# Altium schematic sheet robocar.SchDoc: FHGR_A3_landscape
size A2; Date: 18.07.2017; DrawnBy: G.P. Catregn; Organization: HTW Chur; Address1: Pulvermühlestrasse 57; Address2: 7004 Chur; Address3: Switzerland; DocumentNumber: 1; Revision: V1.0; SheetNumber: 1; SheetTotal: 2; DocumentName: HTW Template
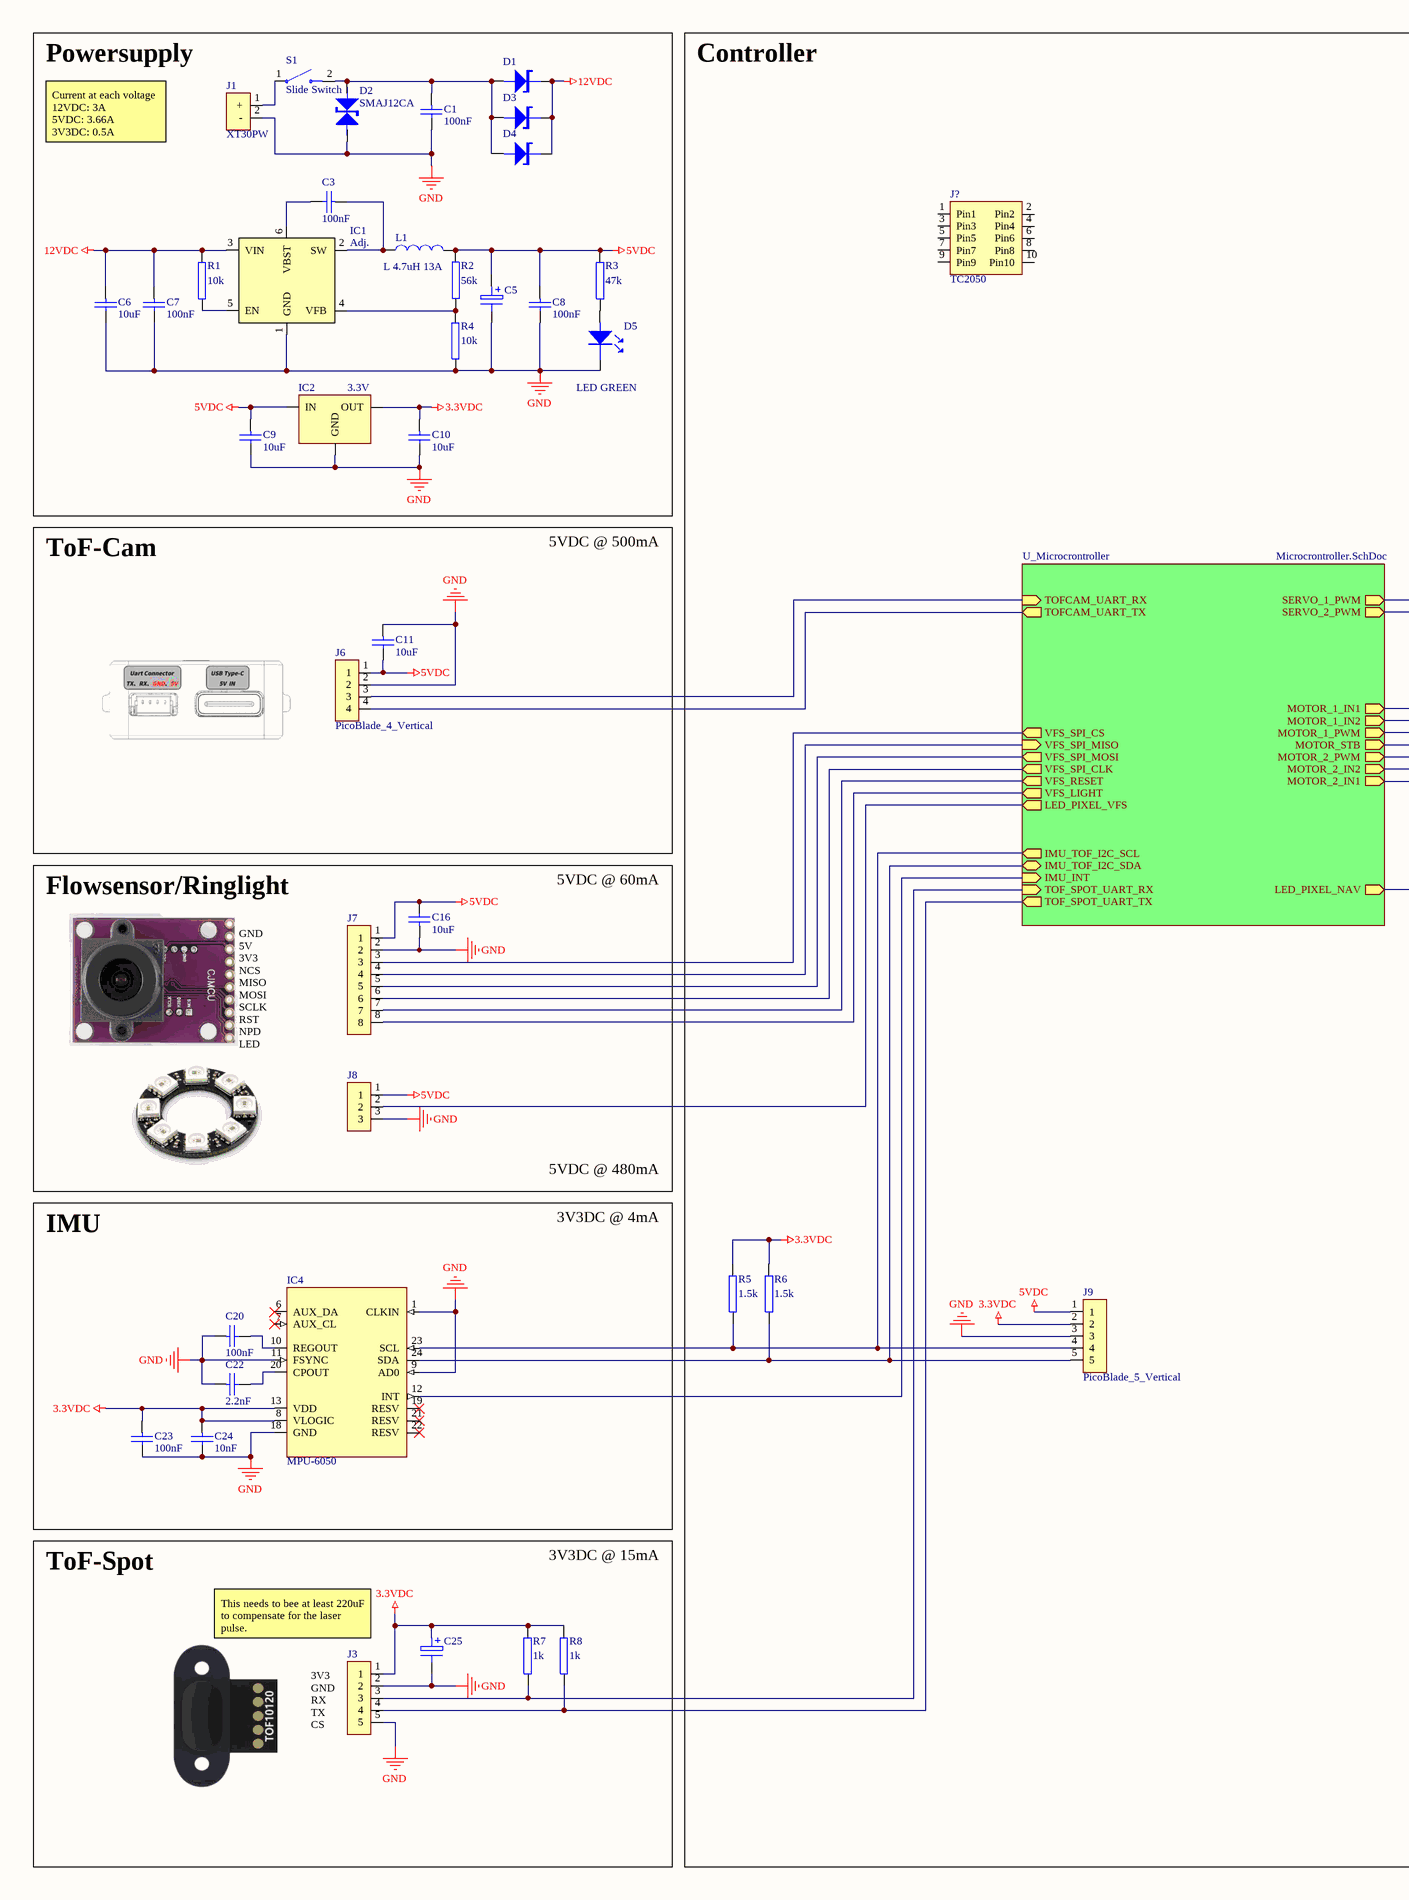
[diagram p0: robocar.SchDoc, left]
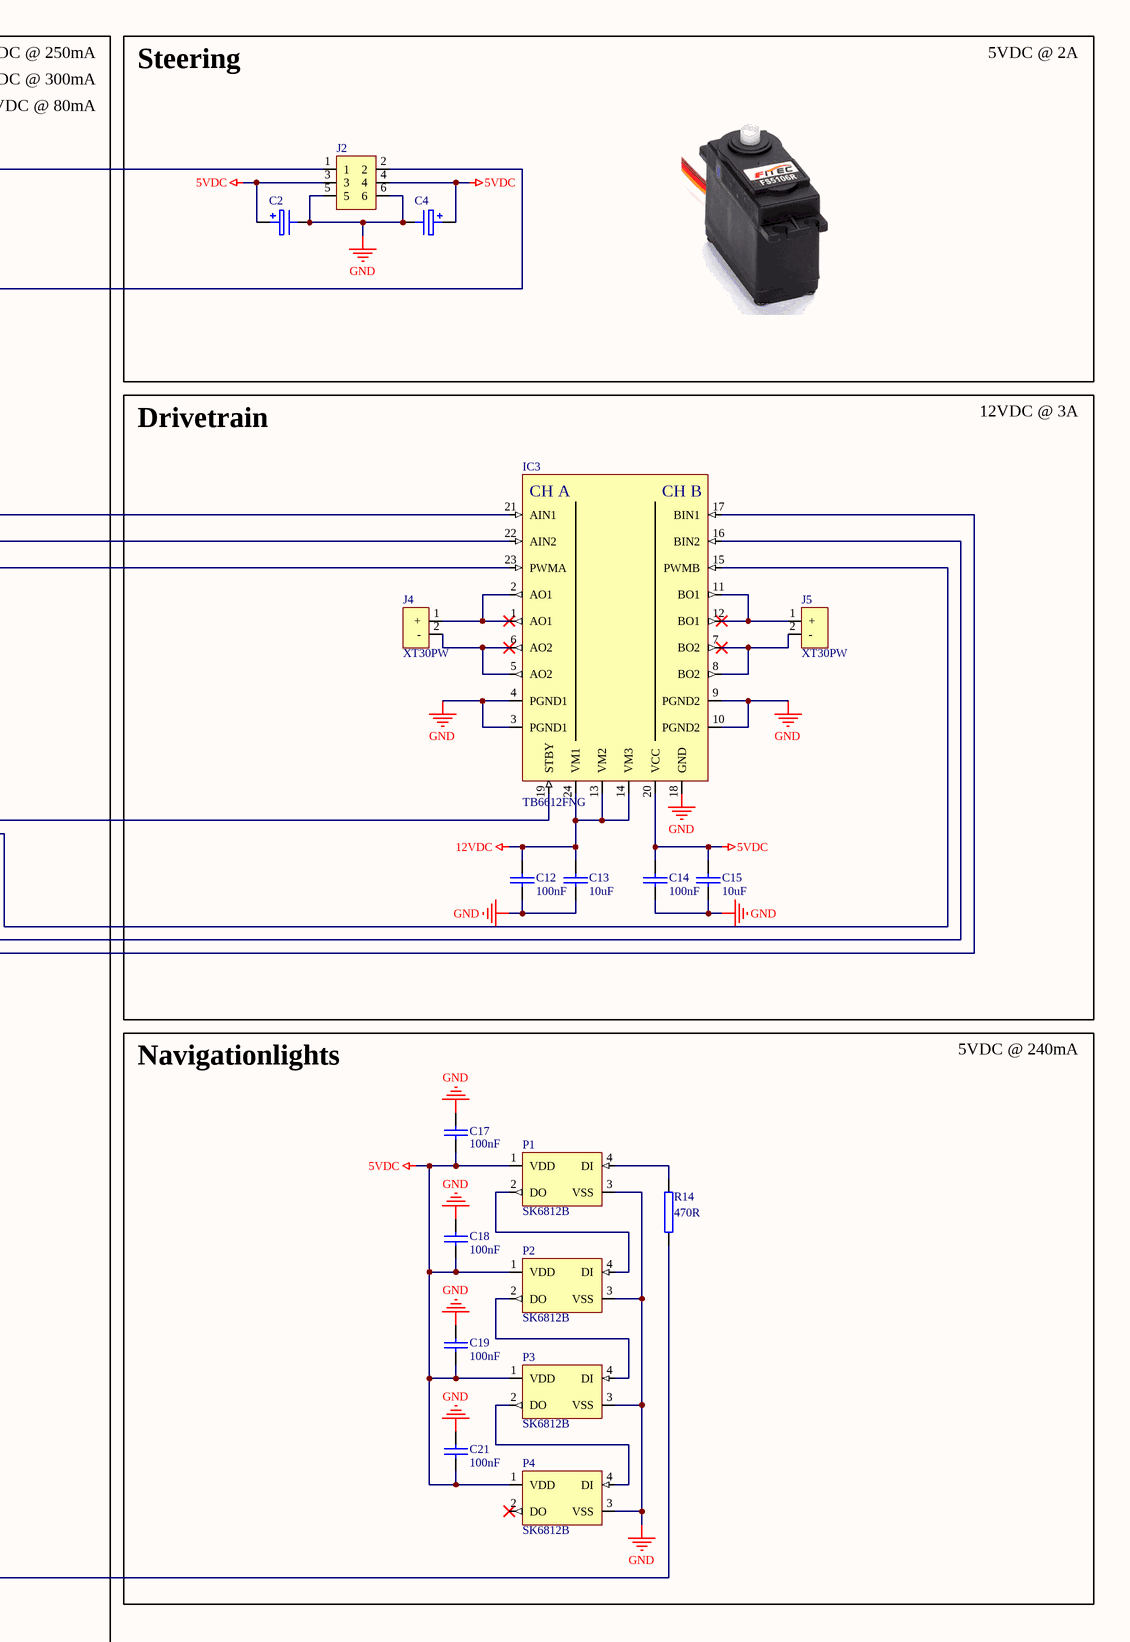
[diagram p1: robocar.SchDoc, right]

## Parts
C1  value 100nF  [0603]  (hidden comment: C 100nF 0603)
C2  C 47uF ALUM  [HA1C470WR]  (value not drawn)
C3  value 100nF  [0603]  (hidden comment: C 100nF 0603)
C4  C 47uF ALUM  [HA1C470WR]  (value not drawn)
C5  C 47uF ALUM  [HA1C470WR]  (value not drawn)
C6  value 10uF  [C_1210_A]  (hidden comment: C 10uF 1210)
C7  value 100nF  [0603]  (hidden comment: C 100nF 0603)
C8  value 100nF  [0603]  (hidden comment: C 100nF 0603)
C9  value 10uF  [0603]  (hidden comment: C 10uF 0603)
C10  value 10uF  [0603]  (hidden comment: C 10uF 0603)
C11  value 10uF  [0603]  (hidden comment: C 10uF 0603)
C12  value 100nF  [0603]  (hidden comment: C 100nF 0603)
C13  value 10uF  [C_1210_A]  (hidden comment: C 10uF 1210)
C14  value 100nF  [0603]  (hidden comment: C 100nF 0603)
C15  value 10uF  [0603]  (hidden comment: C 10uF 0603)
C16  value 10uF  [0603]  (hidden comment: C 10uF 0603)
C17  value 100nF  [0603]  (hidden comment: C 100nF 0603)
C18  value 100nF  [0603]  (hidden comment: C 100nF 0603)
C19  value 100nF  [0603]  (hidden comment: C 100nF 0603)
C20  value 100nF  [0603]  (hidden comment: C 100nF 0603)
C21  value 100nF  [0603]  (hidden comment: C 100nF 0603)
C22  value 2.2nF  [0603]  (hidden comment: C 2.2nF 0603)
C23  value 100nF  [0603]  (hidden comment: C 100nF 0603)
C24  value 10nF  [0603]  (hidden comment: C 10nF 0603)
C25  (no value)  [UCD1H221MNL1GS]
D1  Schottky 60V/2A  [SOD-123FL]  (value not drawn)
D2  SMAJ12CA  [SMA]
D3  Schottky 60V/2A  [SOD-123FL]  (value not drawn)
D4  Schottky 60V/2A  [SOD-123FL]  (value not drawn)
D5  LED GREEN  [LED_1206]
IC1  Voltage Out: Adj.  [SOT23-6]  (hidden comment: Buck_5A_17V)
IC2  Voltage Out: 3.3V  [SOT223]  (hidden comment: LDO_1A_3V3)
IC3  TB6612FNG  [SOP65P760X160-24N]
IC4  MPU-6050  [MPU_6050]
J1  XT30PW  [XT30PW-UP-M]
J2  Pinheader_2x3  [61300621121]  (value not drawn)
J3  PicoBlade_5_Vertical  [PicoBlade_5_Vertical]  (value not drawn)
J4  XT30PW  [XT30PW-UP-F]
J5  XT30PW  [XT30PW-UP-F]
J6  PicoBlade_4_Vertical  [PicoBlade_4_Vertical]
J7  PicoBlade_8_Vertical  [PicoBlade_8_Vertical]  (value not drawn)
J8  PicoBlade_3_Vertical  [PicoBlade_3_Vertical]  (value not drawn)
J9  PicoBlade_5_Vertical  [PicoBlade_5_Vertical]
J?  TC2050  [TC2050]
L1  L 4.7uH 13A  [SRP1040VA]
P1  SK6812B  [SK6812B]
P2  SK6812B  [SK6812B]
P3  SK6812B  [SK6812B]
P4  SK6812B  [SK6812B]
R1  value 10k  [0805]  (hidden comment: R 10K 0805)
R2  value 56k  [0805]  (hidden comment: R 56K 0805)
R3  value 47k  [0805]  (hidden comment: R 47K 0805)
R4  value 10k  [0805]  (hidden comment: R 10K 0805)
R5  value 1.5k  [0805]  (hidden comment: R 1K5 0805)
R6  value 1.5k  [0805]  (hidden comment: R 1K5 0805)
R7  value 1k  [0805]  (hidden comment: R 1K 0805)
R8  value 1k  [0805]  (hidden comment: R 1K 0805)
R14  value 470R  [0805]  (hidden comment: R 220R 0805)
S1  Slide Switch  [SW_GF_123_0054]

## Blocks framed on the sheet
Powersupply: C1 C3 C5-C10 D1-D5 IC1 IC2 J1 L1 R1-R4 S1
Controller: J9 J? R5 R6
Steering: C2 C4 J2
Drivetrain: C12-C15 IC3 J4 J5
ToF-Cam: C11 J6
Flowsensor/Ringlight: C16 J7 J8
Navigationlights: C17-C19 C21 P1-P4 R14
IMU: C20 C22-C24 IC4
ToF-Spot: C25 J3 R7 R8

## Sub-sheets
U_Microcrontroller = Microcrontroller.SchDoc: TOFCAM_UART_RX (in), VFS_SPI_MOSI (out), VFS_SPI_MISO (in), VFS_SPI_CS (out), VFS_SPI_CLK (out), VFS_RESET (out), TOFCAM_UART_TX (out), TOF_SPOT_UART_RX (in), TOF_SPOT_UART_TX (out), LED_PIXEL_VFS (out), LED_PIXEL_NAV (out), IMU_TOF_I2C_SCL (out), IMU_TOF_I2C_SDA (bidir), MOTOR_1_IN1 (out), MOTOR_1_IN2 (out), MOTOR_1_PWM (out), MOTOR_2_IN1 (out), MOTOR_2_IN2 (out), MOTOR_2_PWM (out), MOTOR_STB (out), SERVO_1_PWM (out), SERVO_2_PWM (out), VFS_LIGHT (out), IMU_INT (in)

## Nets
3.3VDC: C10.1 C23.1 C24.1 C25.1 IC2.D(OUT) IC4.8(VLOGIC) IC4.13(VDD) J3.1 J9.2 R5.2 R6.2 R7.2 R8.2
5VDC: C2.1 C4.1 C5.1 C8.1 C9.1 C11.2 C14.1 C15.1 C16.2 C17.1 C18.1 C19.1 C21.1 IC2.S(IN) IC3.20(VCC) J2.3 J2.4 J6.1 J7.1 J8.1 J9.1 L1.2 P1.1(VDD) P2.1(VDD) P3.1(VDD) P4.1(VDD) R2.1 R3.2
12VDC: C6.1 C7.1 C12.1 C13.1 D1.K D3.K D4.K IC1.3(VIN) IC3.13(VM2) IC3.14(VM3) IC3.24(VM1) R1.2
GND: C1.2 C2.2 C4.2 C5.2 C6.2 C7.2 C8.2 C9.2 C10.2 C11.1 C12.2 C13.2 C14.2 C15.2 C16.1 C17.2 C18.2 C19.2 C20.1 C21.2 C22.1 C23.2 C24.2 C25.2 D2.A D5.K IC1.1(GND) IC2.G(GND) IC3.3(PGND1) IC3.4(PGND1) IC3.9(PGND2) IC3.10(PGND2) IC3.18(GND) IC4.1(CLKIN) IC4.9(AD0) IC4.11(FSYNC) IC4.18(GND) J1.2(-) J2.5 J2.6 J3.2 J3.5 J6.2 J7.2 J8.3 J9.3 P1.3(VSS) P2.3(VSS) P3.3(VSS) P4.3(VSS) R4.1
NetC1_1: C1.1 D1.A D2.K D3.A D4.A S1.2(C)
NetC3_1: C3.1 IC1.2(SW) L1.1
NetC3_2: C3.2 IC1.6(VBST)
NetC20_2: C20.2 IC4.10(REGOUT)
NetC22_2: C22.2 IC4.20(CPOUT)
NetD5_A: D5.A R3.1
NetIC1_4: IC1.4(VFB) R2.2 R4.2
NetIC1_5: IC1.5(EN) R1.1
NetIC3_1: IC3.1(AO1) IC3.2(AO1) J4.1(+)
NetIC3_5: IC3.5(AO2) IC3.6(AO2) J4.2(-)
NetIC3_7: IC3.7(BO2) IC3.8(BO2) J5.2(-)
NetIC3_11: IC3.11(BO1) IC3.12(BO1) J5.1(+)
NetIC3_15: IC3.15(PWMB) ; sheet U_Microcrontroller/MOTOR_2_PWM
NetIC3_16: IC3.16(BIN2) ; sheet U_Microcrontroller/MOTOR_2_IN2
NetIC3_17: IC3.17(BIN1) ; sheet U_Microcrontroller/MOTOR_2_IN1
NetIC3_19: IC3.19(STBY) ; sheet U_Microcrontroller/MOTOR_STB
NetIC3_21: IC3.21(AIN1) ; sheet U_Microcrontroller/MOTOR_1_IN1
NetIC3_22: IC3.22(AIN2) ; sheet U_Microcrontroller/MOTOR_1_IN2
NetIC3_23: IC3.23(PWMA) ; sheet U_Microcrontroller/MOTOR_1_PWM
NetIC4_12: IC4.12(INT) ; sheet U_Microcrontroller/IMU_INT
NetIC4_23: IC4.23(SCL) J9.4 R5.1 ; sheet U_Microcrontroller/IMU_TOF_I2C_SCL
NetIC4_24: IC4.24(SDA) J9.5 R6.1 ; sheet U_Microcrontroller/IMU_TOF_I2C_SDA
NetJ1_1: J1.1(+) S1.1(A)
NetJ2_1: J2.1 ; sheet U_Microcrontroller/SERVO_1_PWM
NetJ2_2: J2.2 ; sheet U_Microcrontroller/SERVO_2_PWM
NetJ3_3: J3.3 R7.1 ; sheet U_Microcrontroller/TOF_SPOT_UART_RX
NetJ3_4: J3.4 R8.1 ; sheet U_Microcrontroller/TOF_SPOT_UART_TX
NetJ6_3: J6.3 ; sheet U_Microcrontroller/TOFCAM_UART_RX
NetJ6_4: J6.4 ; sheet U_Microcrontroller/TOFCAM_UART_TX
NetJ7_3: J7.3 ; sheet U_Microcrontroller/VFS_SPI_CS
NetJ7_4: J7.4 ; sheet U_Microcrontroller/VFS_SPI_MISO
NetJ7_5: J7.5 ; sheet U_Microcrontroller/VFS_SPI_MOSI
NetJ7_6: J7.6 ; sheet U_Microcrontroller/VFS_SPI_CLK
NetJ7_7: J7.7 ; sheet U_Microcrontroller/VFS_RESET
NetJ7_8: J7.8 ; sheet U_Microcrontroller/VFS_LIGHT
NetJ8_2: J8.2 ; sheet U_Microcrontroller/LED_PIXEL_VFS
NetP1_2: P1.2(DO) P2.4(DI)
NetP1_4: P1.4(DI) R14.2
NetP2_2: P2.2(DO) P3.4(DI)
NetP3_2: P3.2(DO) P4.4(DI)
NetR14_1: R14.1 ; sheet U_Microcrontroller/LED_PIXEL_NAV

Not connected (* = marked no-connect by the designer): IC4 6(AUX_DA)* 7(AUX_CL)* 19(RESV)* 21(RESV)* 22(RESV)*; J? 1(Pin1) 2(Pin2) 3(Pin3) 4(Pin4) 5(Pin5) 6(Pin6) 7(Pin7) 8(Pin8) 9(Pin9) 10(Pin10); P4 2(DO)*

## Notes on the sheet
- STM32: 3V3DC @ 250mA
- ESP32: 5VDC @ 300mA
- Stati: 5VDC @ 80mA
- 5VDC @ 2A
- Current at each voltage
  12VDC: 3A
  5VDC: 3.66A
  3V3DC: 0.5A
- 12VDC @ 3A
- 5VDC @ 500mA
- 5VDC @ 60mA
- 5VDC @ 240mA
- GND
  5V
  3V3
  NCS
  MISO
  MOSI
  SCLK
  RST
  NPD
  LED
- 5VDC @ 480mA
- 3V3DC @ 4mA
- 3V3DC @ 15mA
- (near J3) This needs to bee at least 220uF to compensate for the laser pulse.
- (near J3) 3V3
  GND
  RX
  TX
  CS
- Drawn by:
- Title:
- Date:
- File:
- Sheet
- of
- Size:
- Revision:
- A2
- (in symbol TB6612FNG) CH A; CH B

## Library data of the parts
C1 C3 C7 C8 C12 C14 C17-C21 C23 = C_100nF_0603: TempKoeff: Y5V; Tolerance: -20%/+80%; Voltage: 50V; Part ID: C_100nF_0603; Price 1pc (CHF): 0.1; Supplier 1: Digi-Key; Supplier Part Number 1: 1276-1012-1-ND
C2 C4 C5 = C_47uF_ALUM: Tolerance: 20%; Voltage: 16V; VALUE: 47uF; Part ID: C_47uF_ALUM; Price 1pc (CHF): 0.08; Supplier 1: Digi-Key; Supplier Part Number 1: PCE4190TR-ND
C6 C13 = C_10uF_1210: TempKoeff: X7S; Tolerance: 10%; Voltage: 50V; Part ID: C_10uF_1210; Price 1pc (CHF): 0.81; Supplier 1: Digi-Key; Supplier Part Number 1: 445-7004-1-ND
C9-C11 C15 C16 = C_10uF_0603: TempKoeff: X5R; Tolerance: 10%; Voltage: 16V; Part ID: C_10uF_0603; Price 1pc (CHF): 0.40; Supplier 1: Digi-Key; Supplier Part Number 1: 490-12317-1-ND
C22 = C_2200pF_0603: TempKoeff: X7R; Tolerance: 10%; Voltage: 50V; Part ID: C_2200pF_0603; Price 1pc (CHF): 0.1; Supplier 1: Digi-Key; Supplier Part Number 1: 399-1085-1-ND
C24 = C_10000pF_0603: TempKoeff: X7R; Tolerance: 10%; Voltage: 50V; Part ID: C_10000pF_0603; Price 1pc (CHF): 0.10; Supplier 1: Digi-Key; Supplier Part Number 1: 1276-1009-1-ND
C25 = C_200u: Supplier 1: Digi-Key; Supplier Part Number 1: 493-6390-1-ND
D1 D3 D4 = D_NTS260ESF: Voltage: 60V; Current: 2A; Forward Voltage: 650mV@2A; Part ID: D_NTS260ESF; Price 10pcs: 0.29; Supplier 1: Digi-Key; ComponentLink1Description: Datasheet; ComponentLink1URL: https://www.onsemi.com/pub/Collateral/NTS260ESF-D.PDF; Supplier Part Number 1: NTS260ESFT3GOSCT-ND
D2 = D_SMAJ12CA: Voltage: 12V; Current: 20.1A; Part ID: D_SMAJ12CA; Price 10pcs: 0.39; Supplier 1: Digi-Key; ComponentLink1Description: Datasheet; ComponentLink1URL: https://www.mccsemi.com/pdf/Products/SMAJ5.0-SMAJ440CA(SMA).pdf; Supplier Part Number 1: SMAJ12CA-TPMSCT-ND
D5 = LED_GREEN_1206: Peak Wavelenght: 565nm; Part ID: LED_GREEN_1206; Price 10pcs: 0.226; Supplier 1: Digi-Key; Supplier Part Number 1: 67-1357-1-ND; ComponentLink1Description: Datasheet; ComponentLink1URL: https://media.digikey.com/pdf/Data%20Sheets/Lite-On%20PDFs/LTST-C230KGKT.pdf
IC1 = TPS565208: Voltage Max: 17; Current: 5A; Frequency: 500kHz; Part ID: TPS565208; Price 10pcs: 1.1; Supplier 1: Digi-Key; ComponentLink1Description: Datasheet; ComponentLink1URL: https://www.ti.com/general/docs/suppproductinfo.tsp?distId=10&gotoUrl=https%3A%2F%2Fwww.ti.com%2Flit%2Fgpn%2Ftps565208; Supplier Part Number 1: 296-48755-1-ND
IC2 = NCP1117LP: IC NCP1117LP LDO; Voltage Max: 18V; Current: 1A; Part ID: NCP1117LP; Price 10pcs: 0.34; Supplier 1: Digi-Key; ComponentLink1Description: Datasheet; ComponentLink1URL: https://www.onsemi.com/pdf/datasheet/ncp1117lp-d.pdf; Supplier Part Number 1: NCP1117LPST33T3GOSCT-ND
L1 = L_4.7uH_13A: Tolerance: 20%; VALUE: 4.7uH; Part ID: L_4.7uH_13A; Price 1pc (CHF): 2.03; Size: 11mm x 10mm x 4mm; Current: 13A; Supplier 1: Digi-Key; ComponentLink1URL: https://www.bourns.com/docs/product-datasheets/srp1040va.pdf; ComponentLink1Description: Datasheet; Supplier Part Number 1: 118-SRP1040VA-4R7MCT-ND
P1-P4 = SK6812B: Angled; ComponentLink1Description: Supplier; ComponentLink1URL: https://www.digikey.ch/en/products/detail/adafruit-industries-llc/4691/13170955
R1 R4 = R_10k_0805: Tolerance: 1%; Power Dissipation: 125mW; Part ID: R_10k_0805; Price 10pcs (CHF): 0.021; Supplier 1: Digi-Key; Supplier Part Number 1: 311-10.0KCRCT-ND
R2 = R_56k_0805: Tolerance: 1%; Power Dissipation: 125mW; Part ID: R_56k_0805; Price 10pcs (CHF): 0.045; Supplier 1: Digi-Key; Supplier Part Number 1: 311-56.0KCRCT-ND
R3 = R_47k_0805: Tolerance: 1%; Power Dissipation: 125mW; Part ID: R_47k_0805; Price 10pcs (CHF): 0.09; Supplier 1: Digi-Key; Supplier Part Number 1: A106064CT-ND
R5 R6 = R_1k5_0805: Tolerance: 1%; Power Dissipation: 250mW; Part ID: R_1k5_0805; Price 10pcs (CHF): 0.072; Supplier 1: Digi-Key; Supplier Part Number 1: RNCP0805FTD1K50CT-ND
R7 R8 = R_1k_0805: Tolerance: 1%; Power Dissipation: 125mW; Part ID: R_1k_0805; Price 10pcs (CHF): 0.021; Supplier 1: Digi-Key; Supplier Part Number 1: 311-1.00KCRCT-ND
R14 = R_220R_0805: Tolerance: 1%; Power Dissipation: 125mW; Part ID: R_220R_0805; Price 10pcs (CHF): 0.052; Supplier 1: Digi-Key; Supplier Part Number 1: A129741CT-ND
S1 = Slide_Switch: Voltage: 125V; Current: 8.5A; Part ID: Slide_Switch; Price 1pc (CHF): 1.17; Dimension: 10mmx16.5mmx8.8mm; Supplier 1: Digi-Key; ComponentLink1Description: Datasheet; ComponentLink1URL: https://media.digikey.com/pdf/Data%20Sheets/CW%20Industries%20PDFs/GF-123-0054_Dwg.pdf; Supplier Part Number 1: CWI333-ND
IC3 = TB6612FNG: ComponentLink1Description: Datasheet; ComponentLink1URL: https://toshiba.semicon-storage.com/info/TB6612FNG_datasheet_en_20141001.pdf?did=10660&prodName=TB6612FNG; Supplier 1: Arrow Electronics; Supplier Part Number 1: TB6612FNG,C,8,EL
J2 = Pinheader_2x3: Supplier 1: Rs; Supplier Part Number 1: 8281522P
J3 J9 = PicoBlade_5_Vertical: Supplier 1: Mouser; Supplier Part Number 1: 538-53047-0510
J6 = PicoBlade_4_Vertical: Supplier 1: Mouser; Supplier Part Number 1: 538-53047-0410
J7 = PicoBlade_8_Vertical: Supplier 1: Mouser; Supplier Part Number 1: 538-53047-0810
J8 = PicoBlade_3_Vertical: Supplier 1: Mouser; Supplier Part Number 1: 538-53047-0310